# EasyEDA schematic MolunSmartHomeLights_2021-06-01.json

## Sheets
1 MolunSmartHomeLights: TITLE: MolunSmartHomeLights; REV: 1.0; Date: 2021-05-26; Sheet: 1/1; Drawn By: molun; Company: molun
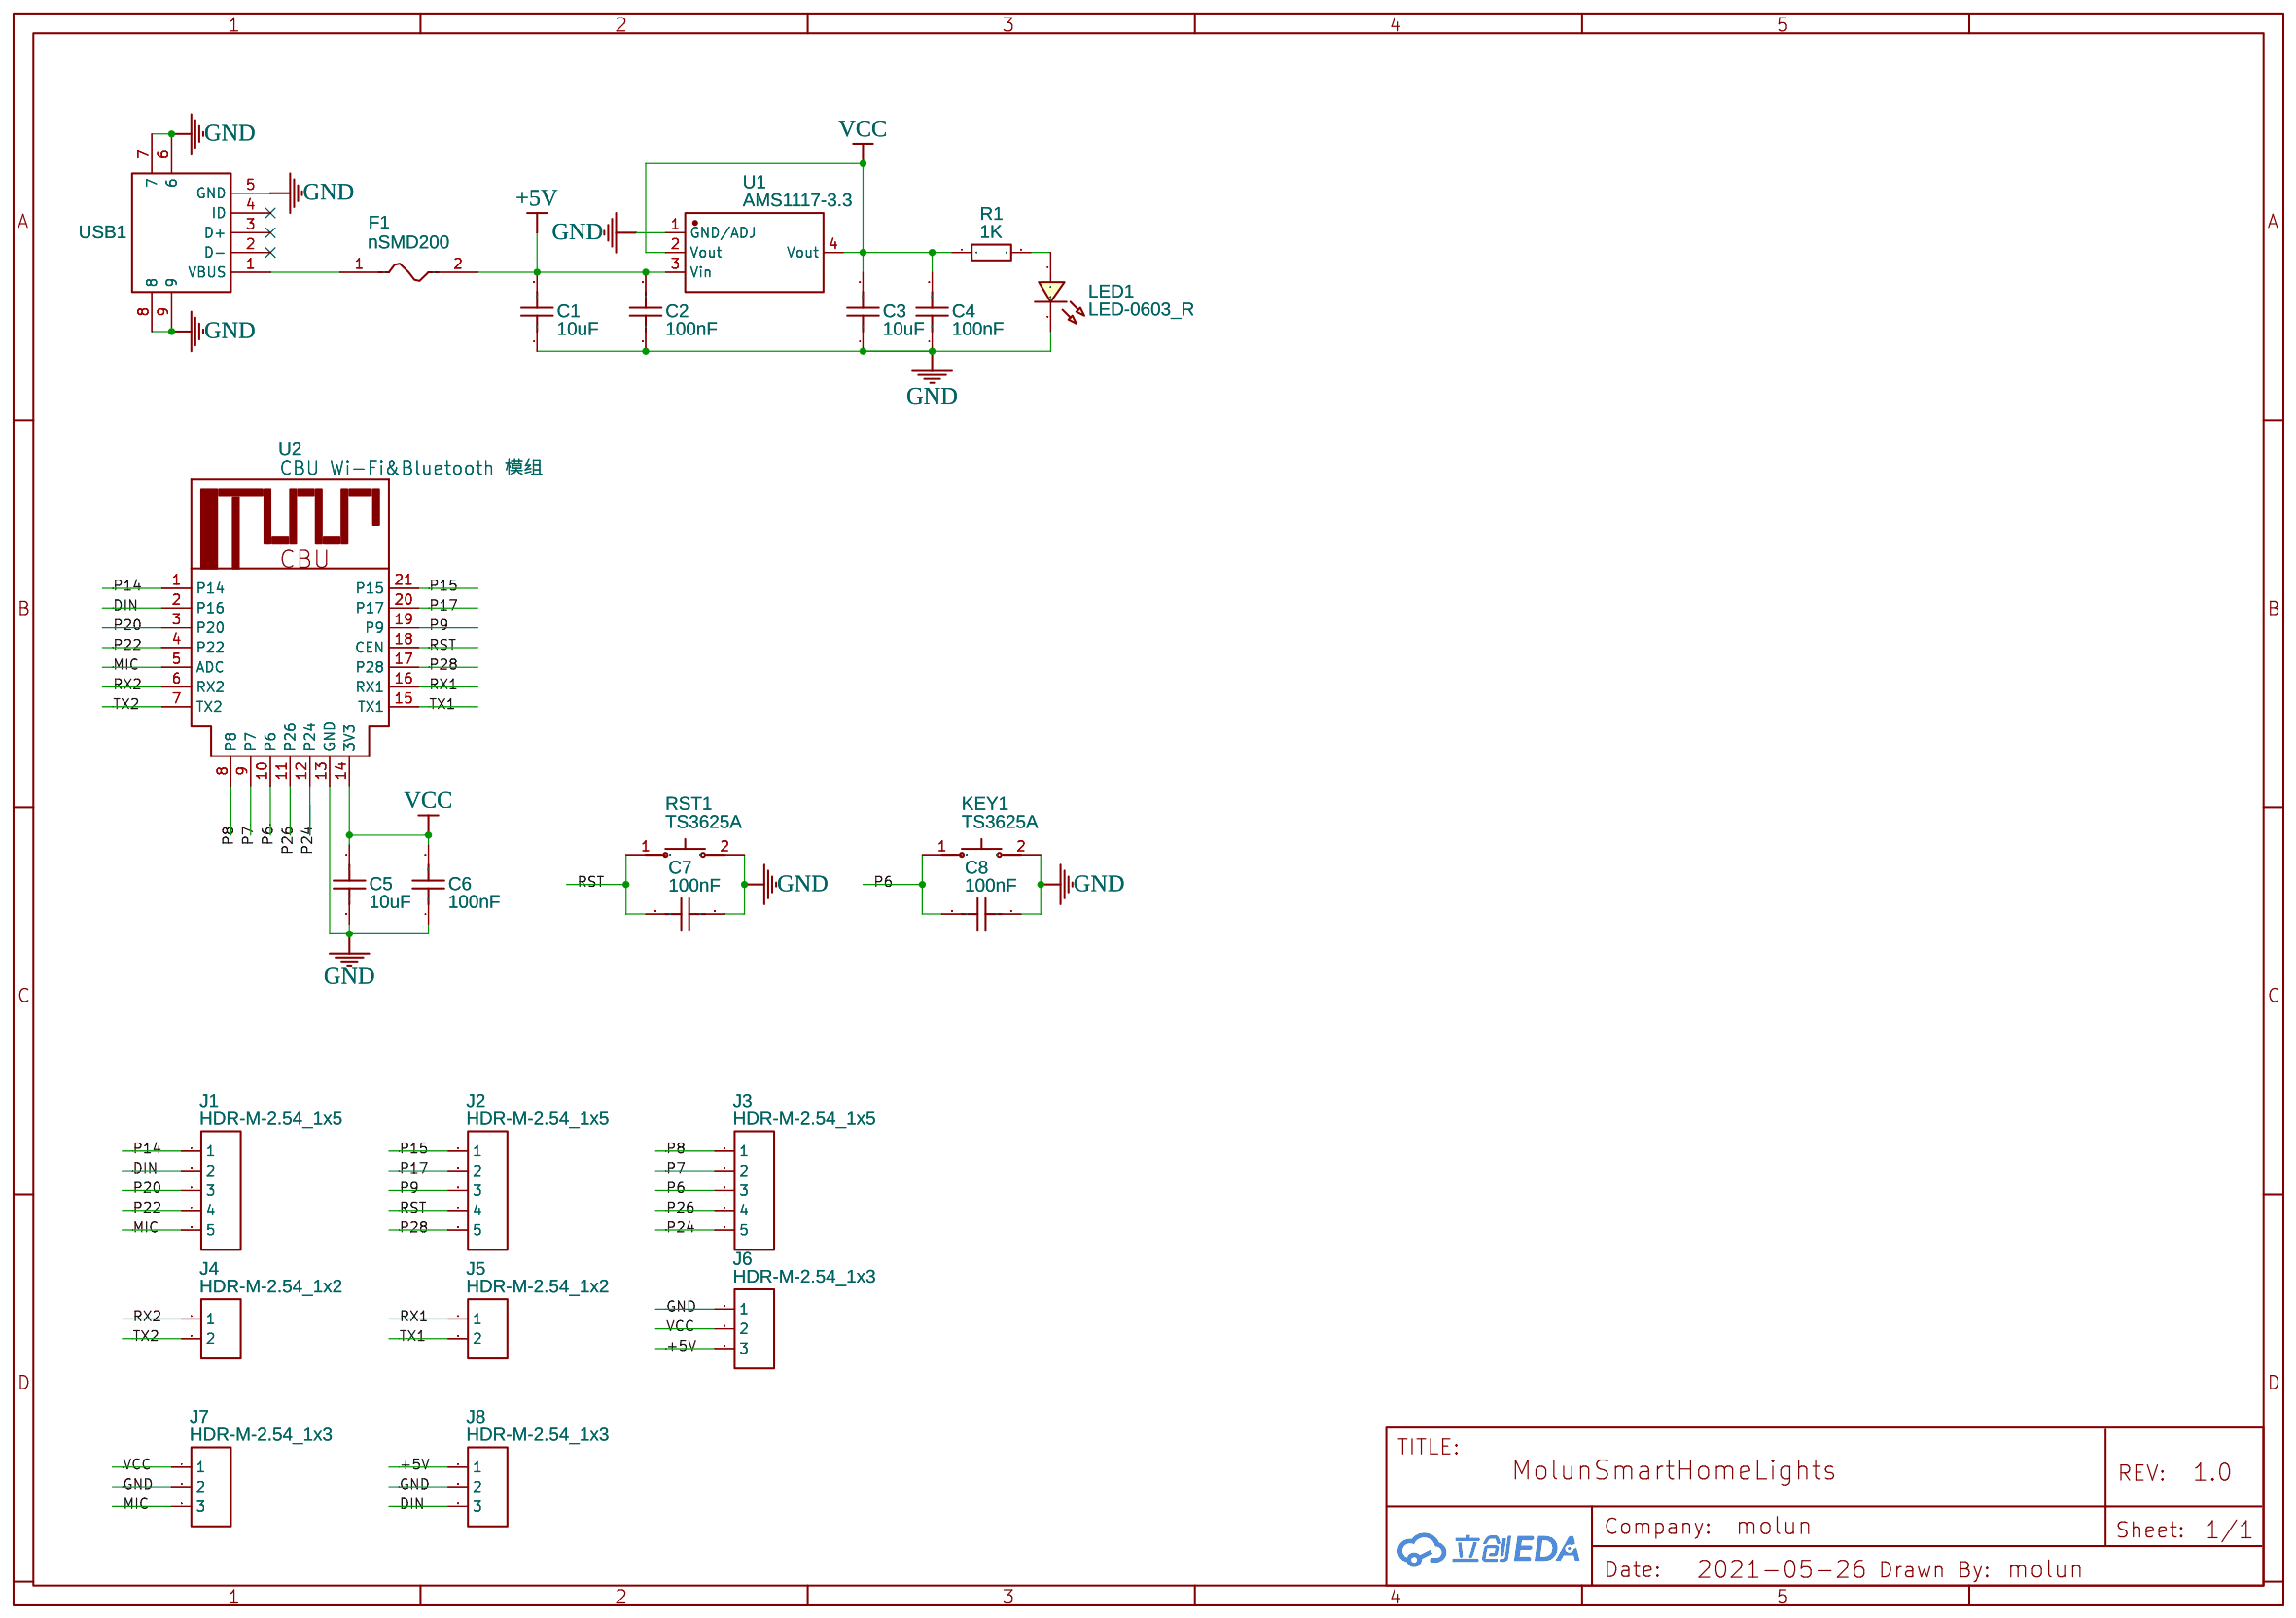
[diagram p0: MolunSmartHomeLights]
2 4合1 WS2812B圆环灯板: TITLE: Sheet_2; Date: 2021-03-10; Company: Your Company
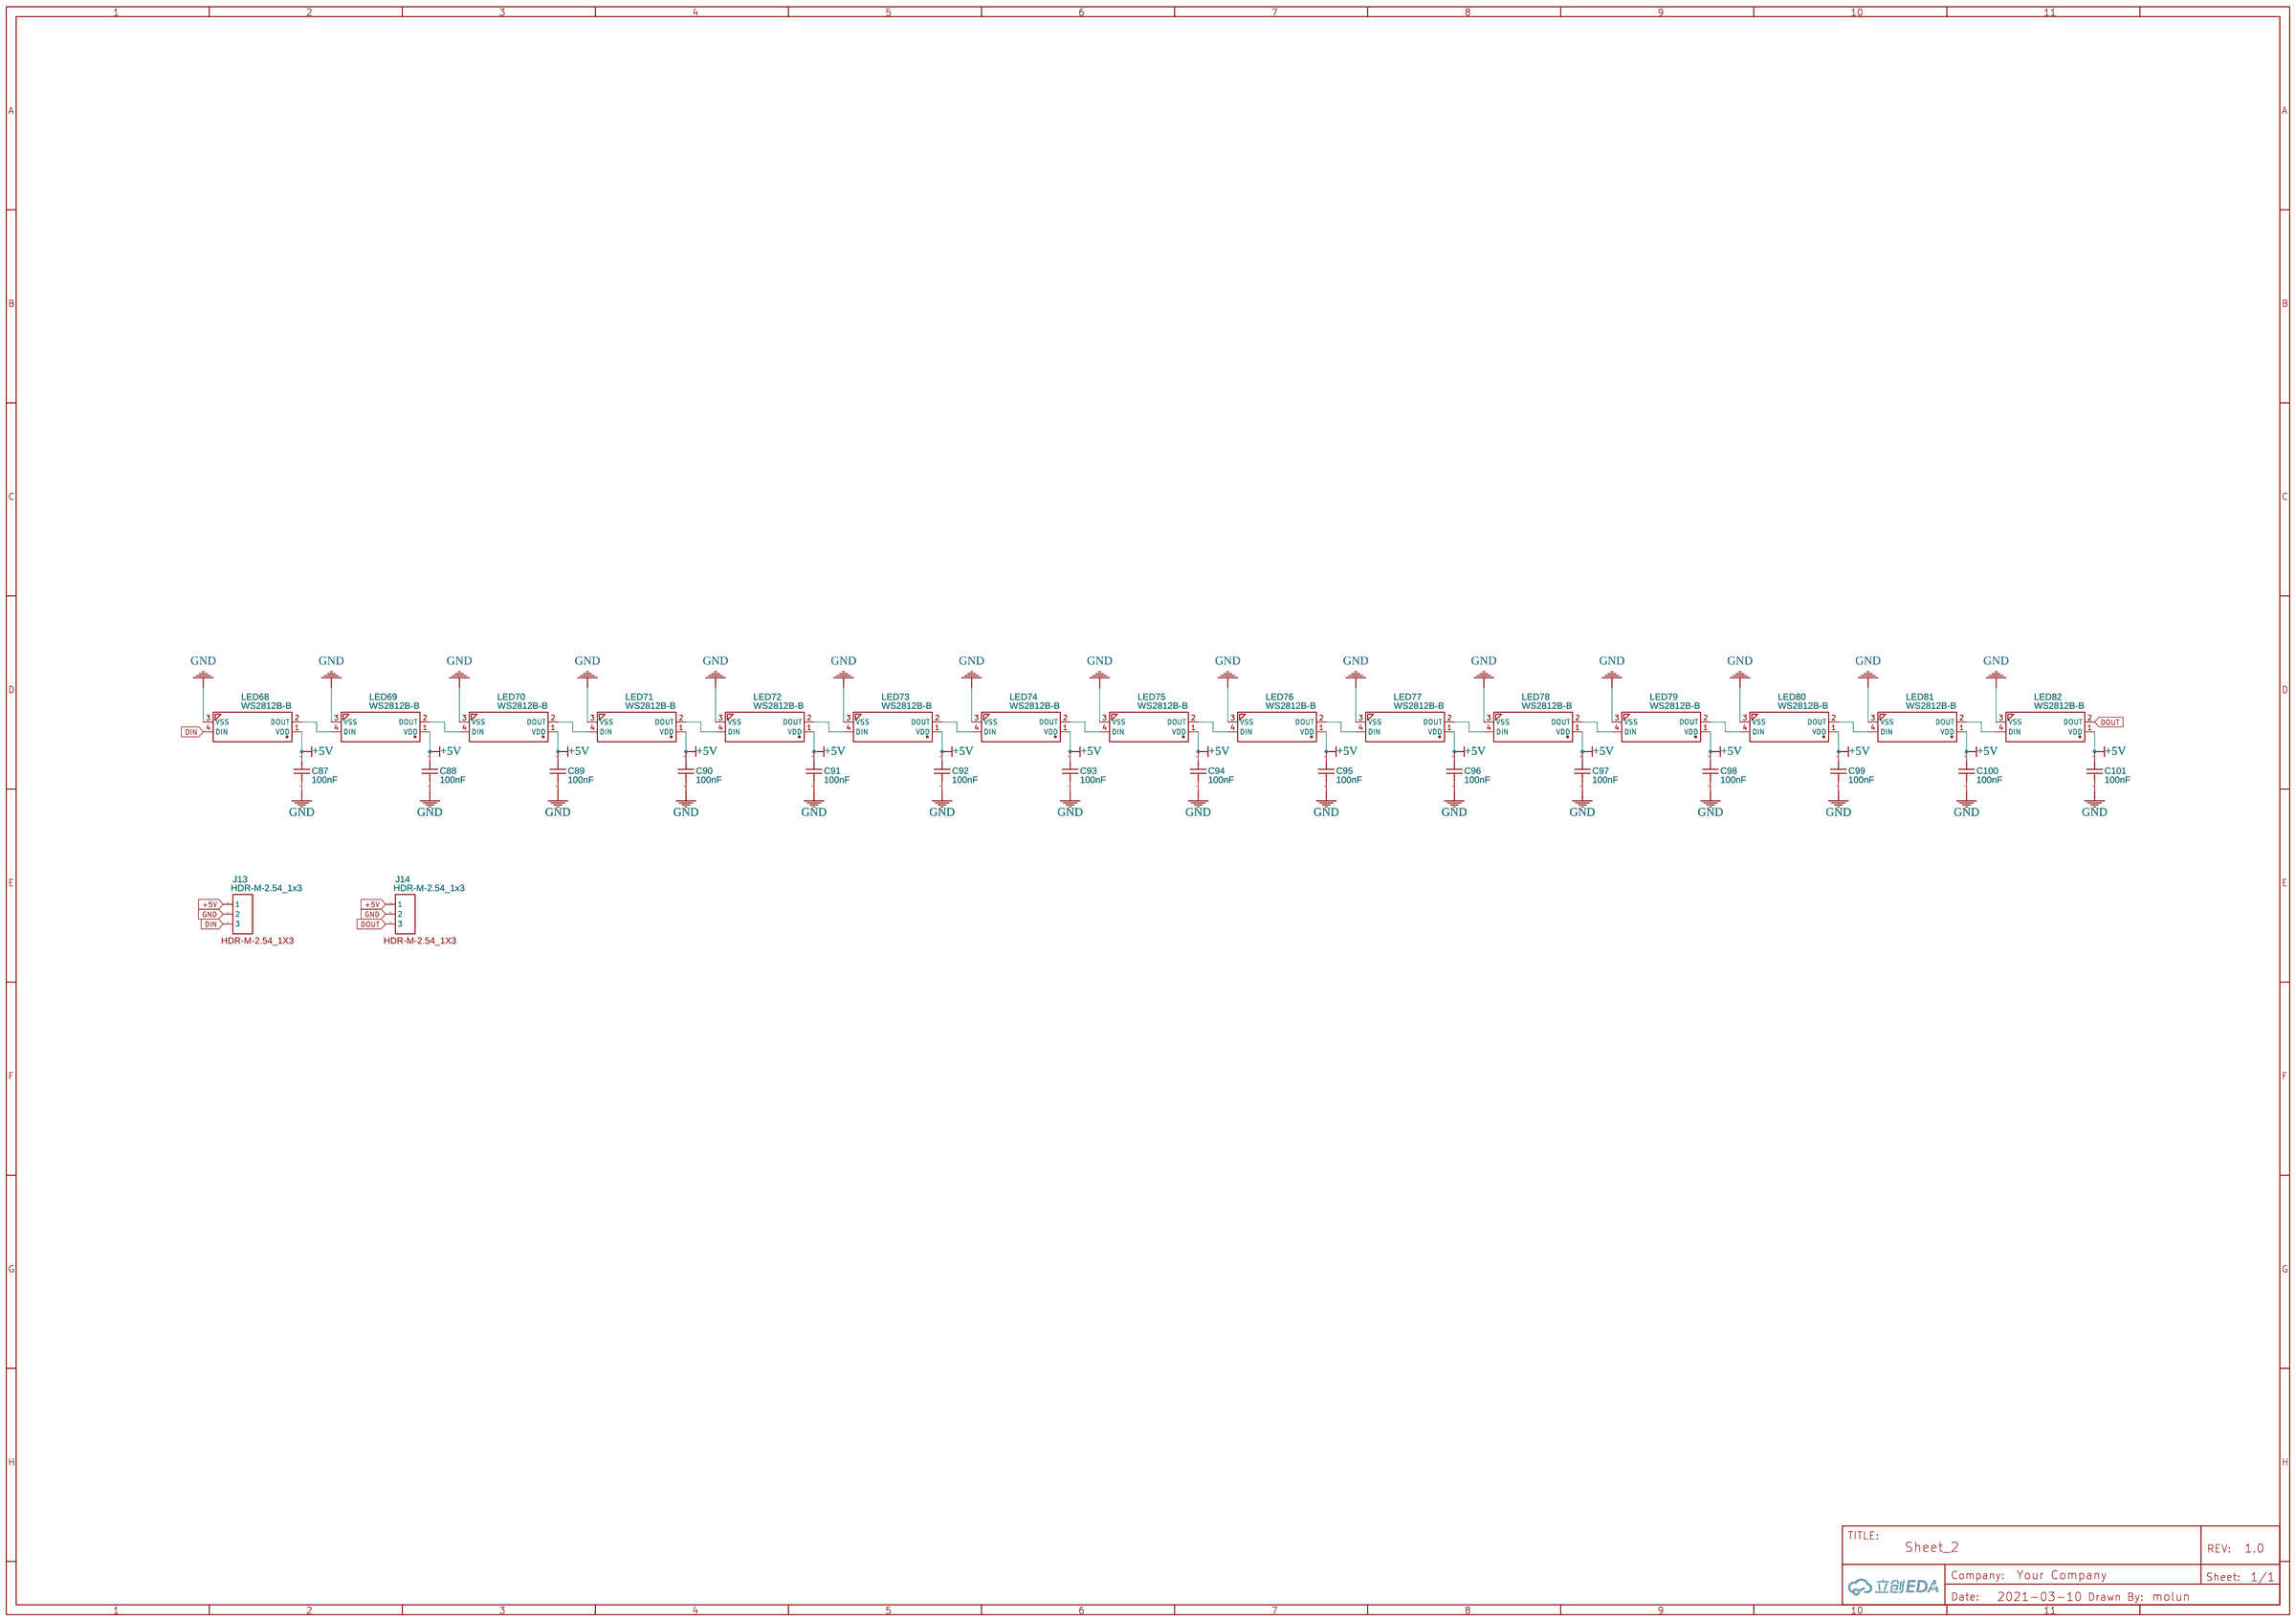
[diagram p1: 4合1 WS2812B圆环灯板]

## Parts
sheet 4合1 WS2812B圆环灯板
C87  100nF  [C0603]
C88  100nF  [C0603]
C89  100nF  [C0603]
C90  100nF  [C0603]
C91  100nF  [C0603]
C92  100nF  [C0603]
C93  100nF  [C0603]
C94  100nF  [C0603]
C95  100nF  [C0603]
C96  100nF  [C0603]
C97  100nF  [C0603]
C98  100nF  [C0603]
C99  100nF  [C0603]
C100  100nF  [C0603]
C101  100nF  [C0603]
J13  HDR-M-2.54_1x3  [HDR-M-2.54_1X3]
J14  HDR-M-2.54_1x3  [HDR-M-2.54_1X3]
LED68  WS2812B-B  [LED-SMD_4P-L5.0-W5.0-TL_WS2812B-B]
LED69  WS2812B-B  [LED-SMD_4P-L5.0-W5.0-TL_WS2812B-B]
LED70  WS2812B-B  [LED-SMD_4P-L5.0-W5.0-TL_WS2812B-B]
LED71  WS2812B-B  [LED-SMD_4P-L5.0-W5.0-TL_WS2812B-B]
LED72  WS2812B-B  [LED-SMD_4P-L5.0-W5.0-TL_WS2812B-B]
LED73  WS2812B-B  [LED-SMD_4P-L5.0-W5.0-TL_WS2812B-B]
LED74  WS2812B-B  [LED-SMD_4P-L5.0-W5.0-TL_WS2812B-B]
LED75  WS2812B-B  [LED-SMD_4P-L5.0-W5.0-TL_WS2812B-B]
LED76  WS2812B-B  [LED-SMD_4P-L5.0-W5.0-TL_WS2812B-B]
LED77  WS2812B-B  [LED-SMD_4P-L5.0-W5.0-TL_WS2812B-B]
LED78  WS2812B-B  [LED-SMD_4P-L5.0-W5.0-TL_WS2812B-B]
LED79  WS2812B-B  [LED-SMD_4P-L5.0-W5.0-TL_WS2812B-B]
LED80  WS2812B-B  [LED-SMD_4P-L5.0-W5.0-TL_WS2812B-B]
LED81  WS2812B-B  [LED-SMD_4P-L5.0-W5.0-TL_WS2812B-B]
LED82  WS2812B-B  [LED-SMD_4P-L5.0-W5.0-TL_WS2812B-B]
sheet MolunSmartHomeLights
C1  10uF  [C0603]
C2  100nF  [C0603]
C3  10uF  [C0603]
C4  100nF  [C0603]
C5  10uF  [C0603]
C6  100nF  [C0603]
C7  100nF  [C0603]
C8  100nF  [C0603]
F1  nSMD200  [F1206]
J1  HDR-M-2.54_1x5  [HDR-M-2.54_1X5]
J2  HDR-M-2.54_1x5  [HDR-M-2.54_1X5]
J3  HDR-M-2.54_1x5  [HDR-M-2.54_1X5]
J4  HDR-M-2.54_1x2  [HDR-M-2.54_1X2]
J5  HDR-M-2.54_1x2  [HDR-M-2.54_1X2]
J6  HDR-M-2.54_1x3  [HDR-M-2.54_1X3]
J7  HDR-M-2.54_1x3  [HDR-M-2.54_1X3]
J8  HDR-M-2.54_1x3  [HDR-M-2.54_1X3]
KEY1  TS3625A  [KEY-SMD_L6.0-W3.5-LS8.4]
LED1  LED-0603_R  [LED0603_RED]
R1  1K  [R0603]
RST1  TS3625A  [KEY-SMD_L6.0-W3.5-LS8.4]
U1  AMS1117-3.3  [SOT-223-3_L6.5-W3.4-P2.30-LS7.0-BR]
U2  CBU Wi-Fi&Bluetooth 模组  [CBU WIFI&BLUETOOTH]
USB1  U254-051T-4BH83-F1S  [MICRO-USB-SMD_U254-051T-4BH83-F1S]

## Library data of the parts
C87-C101 = CC0603KRX7R7BB104: Supplier: LCSC; Supplier Part: C108079; Manufacturer: YAGEO; Contributor: LCSC
J13 J14 = HDR-M-2.54_1x3: Supplier Part: C180248; Supplier: LCSC; Contributor: LCEDA_Lib; Package Display: Yes
LED68-LED82 = WS2812B-B: Supplier: LCSC; Manufacturer: Worldsemi; Contributor: LCSC; Supplier Part: C114586; SMT Type: Extend; JLCPCB SMD: Yes
C1 C3 = CC0603KRX5R6BB106: Supplier: LCSC; Supplier Part: C326057; Manufacturer: YAGEO; Contributor: LCSC
C2 C4 = AC0603KRX7R9BB104: Supplier: LCSC; Supplier Part: C149620; Manufacturer: YAGEO; Contributor: LCSC
C5 = CL10A106MQ8NNNC: Supplier: LCSC; Manufacturer: SAMSUNG; Supplier Part: C1691; JLCPCB Part Class: Extended Part
C6-C8 = CC0603KRX7R7BB104: Supplier: LCSC; Supplier Part: C108079; Manufacturer: YAGEO; Contributor: LCSC; JLCPCB Part Class: Extended Part
F1 = nSMD200: Supplier: LCSC; Manufacturer: TECHFUSE; image: //image.lceda.cn/szlcsc/C70085.jpg; Supplier Part: C70085; SMT Type: Extend; JLCPCB SMD: Yes
J1-J3 = HDR-M-2.54_1x5: Supplier Part: C358687; Supplier: LCSC; Contributor: LCEDA_Lib
J4 J5 = HDR-M-2.54_1x2: Supplier Part: C124375; Supplier: LCSC; Contributor: LCEDA_Lib
J6-J8 = HDR-M-2.54_1x3: Supplier Part: C180248; Supplier: LCSC; Contributor: LCEDA_Lib
KEY1 RST1 = TS3625A: Supplier: LCSC; Supplier Part: C398053; Manufacturer: SHOU HAN; Contributor: LCSC; JLCPCB Part Class: Extended Part
LED1 = LED-0603_R: Manufacturer: EVERLIGHT(台湾亿光); Manufacturer Part: 19-217/R6C-AL1M2VY/3T; Supplier Part: C72044; Supplier: LCSC; Contributor: LCEDA_01
R1 = 0603WAF1001T5E: Supplier: LCSC; Manufacturer: UniOhm; Supplier Part: C21190; SMT Type: Basic; JLCPCB SMD: Yes
U1 = AMS1117-3.3: sourceId: dwIGgezVh; Supplier: LCSC; Manufacturer: AMS; image: //image.lceda.cn/szlcsc/C6186.jpg; Supplier Part: C6186; SMT Type: Basic; JLCPCB SMD: Yes
U2 = CBU Wi-Fi&amp;Bluetooth 模组: Supplier: Tuya; Contributor: chenlf
USB1 = U254-051T-4BH83-F1S: Supplier: LCSC; Supplier Part: C397452; Manufacturer: XKB Enterprise; Contributor: LCSC

## Nets
+5V: C1.2 C2.2 C87.2 C88.2 C89.2 C90.2 C91.2 C92.2 C93.2 C94.2 C95.2 C96.2 C97.2 C98.2 C99.2 C100.2 C101.2 F1.2 J6.3 J8.1 J13.1 J14.1 LED68.1(VDD) LED69.1(VDD) LED70.1(VDD) LED71.1(VDD) LED72.1(VDD) LED73.1(VDD) LED74.1(VDD) LED75.1(VDD) LED76.1(VDD) LED77.1(VDD) LED78.1(VDD) LED79.1(VDD) LED80.1(VDD) LED81.1(VDD) LED82.1(VDD) U1.3(Vin)
GND: C1.1 C2.1 C3.1 C4.1 C5.2 C6.1 C7.1 C8.1 C87.1 C88.1 C89.1 C90.1 C91.1 C92.1 C93.1 C94.1 C95.1 C96.1 C97.1 C98.1 C99.1 C100.1 C101.1 J6.1 J7.2 J8.2 J13.2 J14.2 KEY1.2 LED1.2 LED68.3(VSS) LED69.3(VSS) LED70.3(VSS) LED71.3(VSS) LED72.3(VSS) LED73.3(VSS) LED74.3(VSS) LED75.3(VSS) LED76.3(VSS) LED77.3(VSS) LED78.3(VSS) LED79.3(VSS) LED80.3(VSS) LED81.3(VSS) LED82.3(VSS) RST1.2 U1.1(GND/ADJ) U2.13(GND) USB1.5(GND) USB1.6 USB1.7 USB1.8 USB1.9
VCC: C3.2 C4.2 C5.1 C6.2 J6.2 J7.1 R1.1 U1.2(Vout) U1.4(Vout) U2.14(3V3)
DIN: J1.2 J8.3 J13.3 LED68.4(DIN) U2.2(P16)
DOUT: J14.3 LED82.2(DOUT)
MIC: J1.5 J7.3 U2.5(ADC)
P6: C8.2 J3.3 KEY1.1 U2.10(P6)
P7: J3.2 U2.9(P7)
P8: J3.1 U2.8(P8)
P9: J2.3 U2.19(P9)
P14: J1.1 U2.1(P14)
P15: J2.1 U2.21(P15)
P17: J2.2 U2.20(P17)
P20: J1.3 U2.3(P20)
P22: J1.4 U2.4(P22)
P24: J3.5 U2.12(P24)
P26: J3.4 U2.11(P26)
P28: J2.5 U2.17(P28)
RST: C7.2 J2.4 RST1.1 U2.18(CEN)
RX1: J5.1 U2.16(RX1)
RX2: J4.1 U2.6(RX2)
TX1: J5.2 U2.15(TX1)
TX2: J4.2 U2.7(TX2)
Net-(F1-1): F1.1 USB1.1(VBUS)
Net-(LED1-1): LED1.1 R1.2
Net-(LED68-2): LED68.2(DOUT) LED69.4(DIN)
Net-(LED69-2): LED69.2(DOUT) LED70.4(DIN)
Net-(LED70-2): LED70.2(DOUT) LED71.4(DIN)
Net-(LED71-2): LED71.2(DOUT) LED72.4(DIN)
Net-(LED72-2): LED72.2(DOUT) LED73.4(DIN)
Net-(LED73-2): LED73.2(DOUT) LED74.4(DIN)
Net-(LED74-2): LED74.2(DOUT) LED75.4(DIN)
Net-(LED75-2): LED75.2(DOUT) LED76.4(DIN)
Net-(LED76-2): LED76.2(DOUT) LED77.4(DIN)
Net-(LED77-2): LED77.2(DOUT) LED78.4(DIN)
Net-(LED78-2): LED78.2(DOUT) LED79.4(DIN)
Net-(LED79-2): LED79.2(DOUT) LED80.4(DIN)
Net-(LED80-2): LED80.2(DOUT) LED81.4(DIN)
Net-(LED81-2): LED81.2(DOUT) LED82.4(DIN)

Not connected (* = marked no-connect by the designer): USB1 2(D-)* 3(D+)* 4(ID)*
